# Altium schematic sheet Control_Board_add.SchDoc
size A
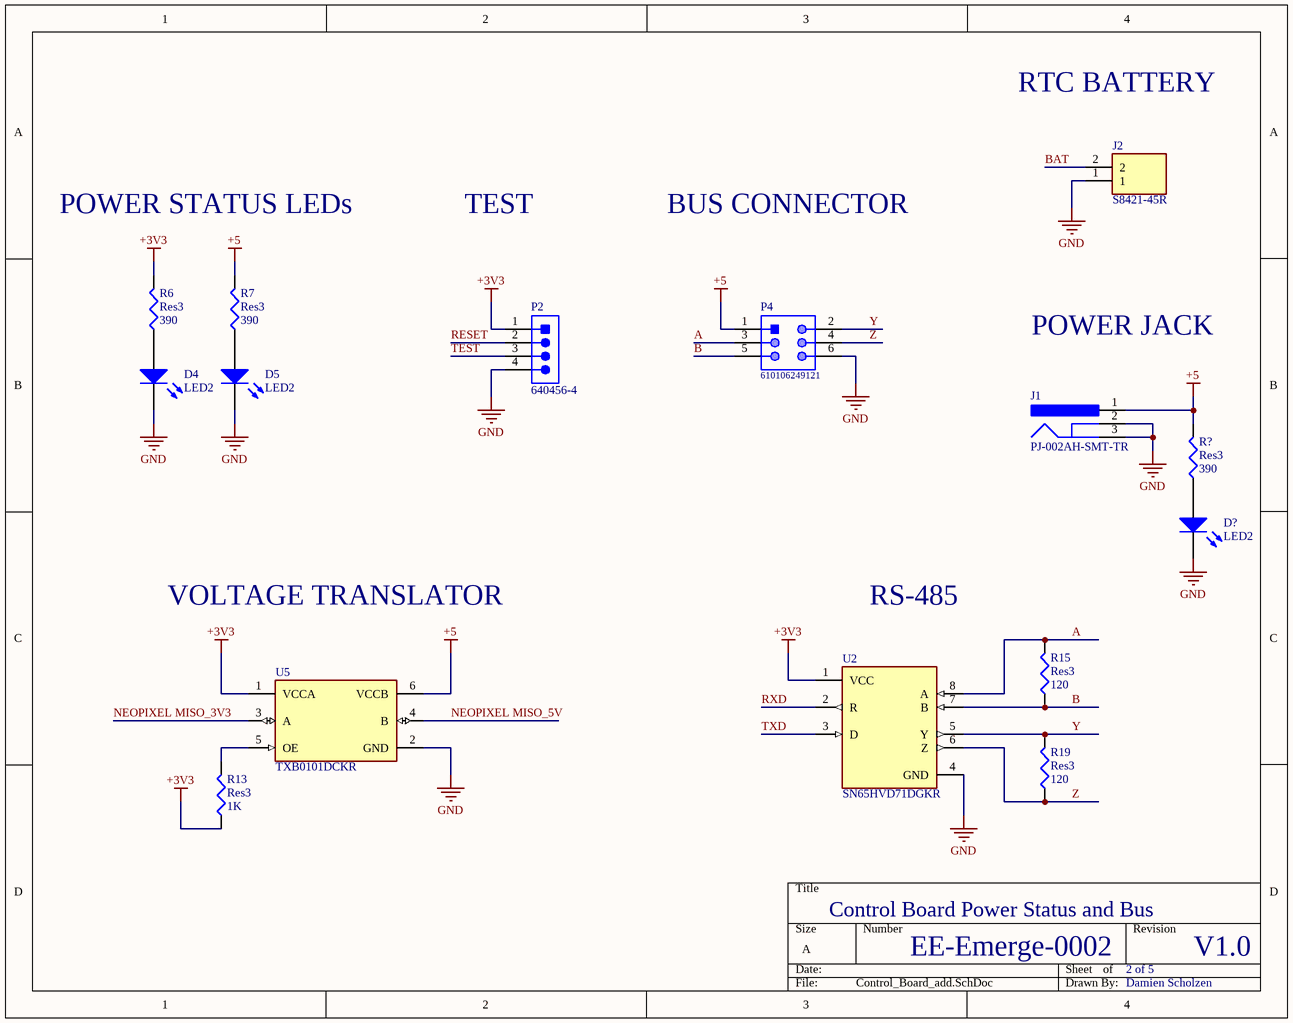
[diagram p0: Control_Board_add.SchDoc]

## Parts
D4  LED2  [3.2X1.6X1.1]
D5  LED2  [3.2X1.6X1.1]
D?  LED2  [3.2X1.6X1.1]
J1  PJ-002AH-SMT-TR  [CUI-PJ-002AH-4_V]
J2  S8421-45R  [S8421-45R_1]
P2  640456-4  [TECO-640456-4]
P4  610106249121  [610106249121]
R6  Res3  value 390  [6-0805_N]
R7  Res3  value 390  [6-0805_N]
R13  Res3  value 1K  [6-0805_N]
R15  Res3  value 120  [6-0805_N]
R19  Res3  value 120  [6-0805_N]
R?  Res3  value 390  [6-0805_N]
U2  SN65HVD71DGKR  [FP-DGK0008A-MFG]
U5  TXB0101DCKR  [FP-DCK0006A-MFG]

## Nets
+3V3: P2.1 R6.2 R13.1 U2.1(VCC) U5.1(VCCA)
+5: J1.1 P4.1 R7.2 R?.2 U5.6(VCCB)
GND: D4.2(K) D5.2(K) D?.2(K) J1.2 J1.3 J2.1 P2.4 P4.6 U2.4(GND) U5.2(GND)
A: P4.3 R15.2 U2.8(A)
B: P4.5 R15.1 U2.7(B)
BAT: J2.2
NEOPIXEL MISO_3V3: U5.3(A)
NEOPIXEL MISO_5V: U5.4(B)
RESET: P2.2
RXD: U2.2(R)
TEST: P2.3
TXD: U2.3(D)
Y: P4.2 R19.2 U2.5(Y)
Z: P4.4 R19.1 U2.6(Z)
NetD4_1: D4.1(A) R6.1
NetD5_1: D5.1(A) R7.1
NetD?_1: D?.1(A) R?.1
NetR13_2: R13.2 U5.5(OE)

## Notes on the sheet
- RTC BATTERY
- POWER STATUS LEDs
- TEST
- BUS CONNECTOR
- POWER JACK
- VOLTAGE TRANSLATOR
- RS-485
- Control Board Power Status and Bus
- EE-Emerge-0002
- 2 of 5
- V1.0
- Damien Scholzen

## Library data of the parts
D4 D5 D? = LED2: Typical RED, GREEN, YELLOW, AMBER GaAs LED; Published: 8-Jun-2000; LatestRevisionDate: 17-Jul-2002; LatestRevisionNote: Re-released for DXP Platform.; PackageVersion: Feb-2002; PackageReference: 3.2X1.6X1.1; Publisher: Altium Limited; PackageDescription: SM LED; 2 Flat Leads
J1 = CMP-2000-06896-1: DC Power Jack, Right Angle, -25 to 85 degC, 4-Pin 14.8 x 9 x 11 mm SMD, RoHS, Tape and Reel; Manufacturer: CUIInc.; Current Rating: 5A; Voltage Rating: 24V; Outside Contact Diameter: 6.5mm; Inside Contact Diameter: 2mm; Insulation Resistance: 100MOhms; Brand: CUI; Contact Plating: Nickel; Contact Gender: Male; Datasheet URL: http://www.cui.com/product/resource/pj-002ah-smt.pdf; Mounting Style: SMD/SMT; Mounting Technology: SurfaceMount; Operating Temperature Range: -25Cto+85C; Flammability Rating: UL94V-0; Mounting Angle: Right; Packaging: Reel; Connector Type: DCPowerJack; Product Category: DCPowerConnectors; Package Description: 4-Pin Surface Mount Device, Body 14.8 x 9 mm, Pitch 6.1 mm; Factory Pack Quantity: 350; Datasheet Version: Rev. 1.03, 11/2012; Contact Material: Brass; Package Reference: PJ-002AH; Housing Material: Polyamide(PA); PartNumber: PJ-002AH; Manufacturer URL: http://www.cui.com/; Product: Jacks; RoHS: True; Termination Style: SMD/SMT
J2 = S8421-45R: Connector; Manufacturer_Name: Harwin; Datasheet Link: https://componentsearchengine.com//S8421-45R.pdf; Mouser2 Part Number: 855-S8421-45R; Mouser2 Price/Stock: https://www.mouser.com/Search/Refine.aspx?Keyword=855-S8421-45R; Manufacturer_Part_Number: S8421-45R
P2 = CMP-2000-05419-1: Male Header, Pitch 2.54 mm, 1 x 4 Position, Height 10.03 mm, Tail Length 3.56 mm, RoHS, Bulk; Manufacturer: TE Connectivity; Material, Housing: Polyester; Primary Type: InterconnectSystem; Mount Angle: Vertical; Color, Housing: White; Current, Rating: 5 / A; Agency Approvals: CSA,UL; Contact Termination Area Plating: Tin; Temperature, Operating: -55to+105 / degC; Standards: RoHSCompliant,ELVCompliant,UL94V-0; Number of Positions: 4; Brand/Series: MTA-100Series; Angle: Straight; Pin Spacing: 0.1 / "; Material, Contact: CopperAlloy; Connector Type: MTA-100; Special Features: Pinstrip; Mounting Hole Size: 0.04 / "; Contact Centerline Spacing: 0.100 / in.; Voltage, Rating: 250 / V; Manufacturer URL: http://www.te.com/; Length, Pin: 0.14 / "; Length, Overall: 0.4 / "; Color: White; Flammability Rating: UL94V-0; Mounting Type: PCMount; Termination: Solder; Datasheet URL: https://datasheet.ciiva.com/16286/eng-ds-82056-mta-0608-16286228.pdf; Number of Contacts: 4; Contact Shape: Square; Contact Mating Area Plating: Tin; Length, Terminal Post: 0.14 / in.; Size, Post: 0.025 / in.; Contact Plating: Tin; Type: PCBPlug; Datasheet Version: Dec-14; Number of Rows: 1
P4 = CMP-1502-01146-1: SMT Angled Pin Header WR-PHD, Pitch 2.54 mm, Dual Row, 6 pins; Manufacturer: Wurth Elektronik; Contact Resistance: 20mOhm; Gender: Male; Withstanding Voltage: 600VAC; Working Voltage: 250VAC; Rated Current: 3A; Pitch: 2.54mm; Pin Number: 6; Package Reference: 610106249121; Mounting Technology: SMT; Row Number: Dual; Manufacturer URL: http://www.we-online.de; Operating Temperature: -40to105degC; Publisher: WurthElektronik; Datasheet URL: https://katalog.we-online.de/em/datasheet/6101xx249121.pdf; Packaging: TapeandReel; Orientation: Angled; Part Number: 610106249121
R6 R7 R15 R19 R? = Res3_4: Resistor; Published: 8-Jun-2000; LatestRevisionDate: 29-May-2009; LatestRevisionNote: IPC-7351 Footprint Added.; PackageReference: J1-0603; Publisher: Altium Limited; PackageDescription: Chip Resistor
R13 = Res3_2: Resistor; Published: 8-Jun-2000; LatestRevisionDate: 29-May-2009; LatestRevisionNote: IPC-7351 Footprint Added.; PackageReference: J1-0603; Publisher: Altium Limited; PackageDescription: Chip Resistor
U2 = CMP-04875-000087-1: IC TRANSCEIVER FULL 1/1 8VSSOP; Operating Supply Voltage: 3.3V; Number of Transmitters: 1; Max Supply Voltage: 3.6V; Logic Function: Receiver; Receiver Hysteresis: 70mV; Simplex/Duplex: Full Duplex; Min Supply Voltage: 3V; Data Rate: 400Kbps; Mount: Surface Mount; Case/Package: VSSOP; Max Operating Temperature: 125°C; Packaging: Tape and Reel; Lead Free: Lead Free; Min Operating Temperature: -40°C; Depth: 3.1mm; RoHS Compliant: Yes; Length: 3.1mm
U5 = CMP-04899-000110-1: IC TRNSLTR BIDIRECTIONAL SC70-6; Number of Bits: 1; Low Level Output Current: 20uA; Data Rate: 100Mbps; Logic Function: Translator; Min Supply Voltage: 1.2V; Turn-On Delay Time: 7.4ns; Propagation Delay: 31ns; High Level Output Current: -20uA; Max Supply Voltage: 5.5V; Series: -; Height: 1mm; Packaging: Tape and Reel; RoHS Compliant: Yes; Width: 1.4mm; Package Quantity: 1; Mount: Surface Mount; Case/Package: SC; Length: 2.15mm; Number of Pins: 6; Max Operating Temperature: 85°C; Contact Plating: Gold; Min Operating Temperature: -40°C; Radiation Hardening: No; Lead Free: Lead Free; Number of Inputs: 1; Number of Channels: 1; REACH SVHC: No SVHC